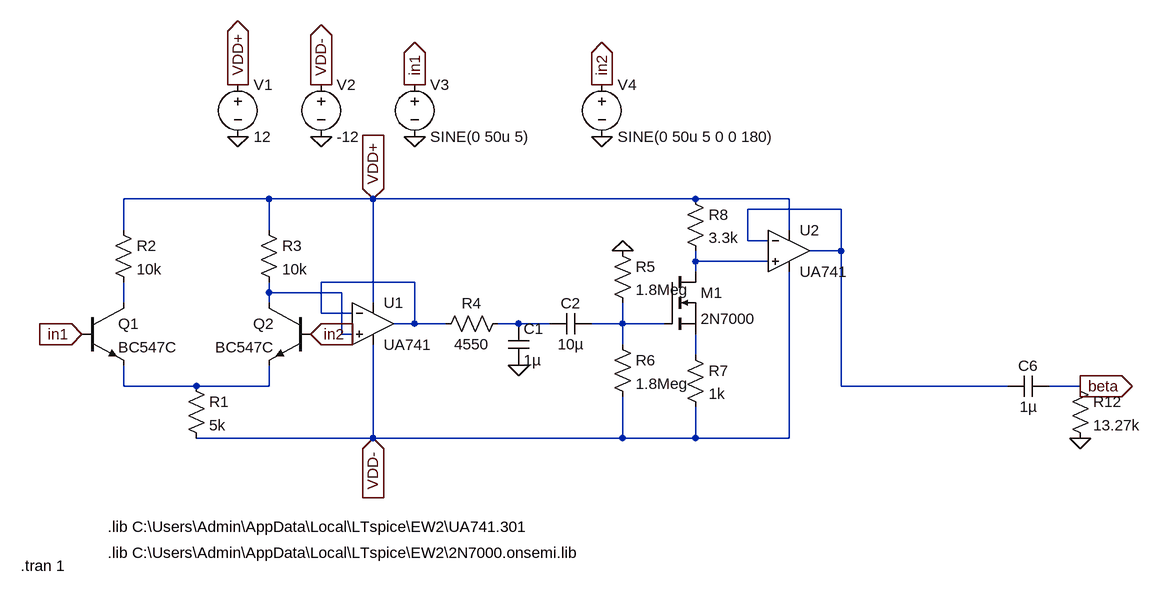
[diagram p0: schematic EW2_project2_final_ckt_using_diff_amps.asc]
EW2_project2_final_ckt_using_diff_amps.asc, the LTspice schematic file:
Version 4
SHEET 1 1660 680
WIRE 288 0 64 0
WIRE 448 0 288 0
WIRE 944 0 448 0
WIRE 1088 0 944 0
WIRE 1168 16 1024 16
WIRE 64 48 64 0
WIRE 288 48 288 0
WIRE 1088 48 1088 0
WIRE 1024 64 1024 16
WIRE 1056 64 1024 64
WIRE 1168 80 1168 16
WIRE 1168 80 1120 80
WIRE 944 96 944 80
WIRE 1056 96 944 96
WIRE 944 112 944 96
WIRE 512 128 368 128
WIRE 288 144 288 128
WIRE 400 144 288 144
WIRE 64 160 64 128
WIRE 288 160 288 144
WIRE 448 160 448 0
WIRE 368 176 368 128
WIRE 416 176 368 176
WIRE 512 192 512 128
WIRE 512 192 480 192
WIRE 560 192 512 192
WIRE 672 192 640 192
WIRE 720 192 672 192
WIRE 832 192 832 160
WIRE 832 192 784 192
WIRE 896 192 832 192
WIRE 400 208 400 144
WIRE 416 208 400 208
WIRE 832 224 832 192
WIRE 944 240 944 208
WIRE 64 288 64 256
WIRE 176 288 64 288
WIRE 288 288 288 256
WIRE 288 288 176 288
WIRE 1168 288 1168 80
WIRE 1424 288 1168 288
WIRE 1536 288 1488 288
WIRE 448 368 448 224
WIRE 448 368 176 368
WIRE 832 368 832 304
WIRE 832 368 448 368
WIRE 944 368 944 320
WIRE 944 368 832 368
WIRE 1088 368 1088 112
WIRE 1088 368 944 368
FLAG 672 256 0
FLAG 832 80 0
FLAG 1536 368 0
FLAG 368 -96 0
FLAG 240 -96 0
FLAG 512 -176 in1
IOPIN 512 -176 Out
FLAG 368 -176 VDD-
IOPIN 368 -176 Out
FLAG 240 -176 VDD+
IOPIN 240 -176 Out
FLAG 0 208 in1
IOPIN 0 208 In
FLAG 448 368 VDD-
IOPIN 448 368 In
FLAG 448 0 VDD+
IOPIN 448 0 In
FLAG 1536 288 beta
IOPIN 1536 288 Out
FLAG 352 208 in2
IOPIN 352 208 In
FLAG 512 -96 0
FLAG 800 -176 in2
IOPIN 800 -176 Out
FLAG 800 -96 0
SYMBOL npn 0 160 R0
SYMATTR InstName Q1
SYMATTR Value BC547C
SYMBOL npn 352 160 M0
SYMATTR InstName Q2
SYMATTR Value BC547C
SYMBOL res 160 272 R0
SYMATTR InstName R1
SYMATTR Value 5k
SYMBOL res 48 32 R0
SYMATTR InstName R2
SYMATTR Value 10k
SYMBOL res 272 32 R0
SYMATTR InstName R3
SYMATTR Value 10k
SYMBOL OpAmps\\opamp2 448 128 R0
SYMATTR InstName U1
SYMATTR Value UA741
SYMBOL nmos 896 112 R0
SYMATTR InstName M1
SYMATTR Value 2N7000
SYMATTR Prefix X
SYMBOL cap 784 176 R90
WINDOW 0 0 32 VBottom 2
WINDOW 3 32 32 VTop 2
SYMATTR InstName C2
SYMATTR Value 10µ
SYMBOL res 816 64 R0
SYMATTR InstName R5
SYMATTR Value 1.8Meg
SYMBOL res 816 208 R0
SYMATTR InstName R6
SYMATTR Value 1.8Meg
SYMBOL res 928 224 R0
SYMATTR InstName R7
SYMATTR Value 1k
SYMBOL res 928 -16 R0
SYMATTR InstName R8
SYMATTR Value 3.3k
SYMBOL OpAmps\\opamp2 1088 16 R0
SYMATTR InstName U2
SYMATTR Value UA741
SYMBOL res 1520 272 R0
SYMATTR InstName R12
SYMATTR Value 13.27k
SYMBOL cap 1488 272 R90
WINDOW 0 0 32 VBottom 2
WINDOW 3 32 32 VTop 2
SYMATTR InstName C6
SYMATTR Value 1µ
SYMBOL res 656 176 R90
WINDOW 0 0 56 VBottom 2
WINDOW 3 32 56 VTop 2
SYMATTR InstName R4
SYMATTR Value 4550
SYMBOL cap 656 192 R0
SYMATTR InstName C1
SYMATTR Value 1µ
SYMBOL voltage 240 -192 R0
WINDOW 123 0 0 Left 0
WINDOW 39 0 0 Left 0
SYMATTR InstName V1
SYMATTR Value 12
SYMBOL voltage 368 -192 R0
WINDOW 123 0 0 Left 0
WINDOW 39 0 0 Left 0
SYMATTR InstName V2
SYMATTR Value -12
SYMBOL voltage 512 -192 R0
WINDOW 123 0 0 Left 0
WINDOW 39 0 0 Left 0
SYMATTR InstName V3
SYMATTR Value SINE(0 50u 5)
SYMBOL voltage 800 -192 R0
WINDOW 123 0 0 Left 0
WINDOW 39 0 0 Left 0
SYMATTR InstName V4
SYMATTR Value SINE(0 50u 5 0 0 180)
TEXT 40 504 Left 2 !.lib C:\\Users\\Admin\\AppData\\Local\\LTspice\\EW2\\UA741.301
TEXT 40 544 Left 2 !.lib C:\\Users\\Admin\\AppData\\Local\\LTspice\\EW2\\2N7000.onsemi.lib
TEXT -94 564 Left 2 !.tran 1

The netlist it stands for:
* EW2_project2_final_ckt_using_diff_amps.asc
Q1 N005 in1 N009 0 BC547C
Q2 N004 in2 N009 0 BC547C
R1 N009 VDD- 5k
R2 VDD+ N005 10k
R3 VDD+ N004 10k
XU1 N004 N003 VDD+ VDD- N003 UA741  ; pins In+ In- V+ V- OUT
XM1 N002 N007 N008 2N7000  ; pins D G S
C2 N007 N006 10µ
R5 0 N007 1.8Meg
R6 N007 VDD- 1.8Meg
R7 N008 VDD- 1k
R8 VDD+ N002 3.3k
XU2 N002 N001 VDD+ VDD- N001 UA741  ; pins In+ In- V+ V- OUT
R12 beta 0 13.27k
C6 beta N001 1µ
R4 N006 N003 4550
C1 N006 0 1µ
V1 VDD+ 0 12
V2 VDD- 0 -12
V3 in1 0 SINE(0 50u 5)
V4 in2 0 SINE(0 50u 5 0 0 180)
.model NPN NPN
.model PNP PNP
.lib standard.bjt
.lib C:\Users\Admin\AppData\Local\LTspice\EW2\UA741.301
.lib C:\Users\Admin\AppData\Local\LTspice\EW2\2N7000.onsemi.lib
.tran 1
.backanno
.end